# Altium schematic sheet COBConnector.SchDoc
size C; SheetNumber: 2; SheetTotal: 3
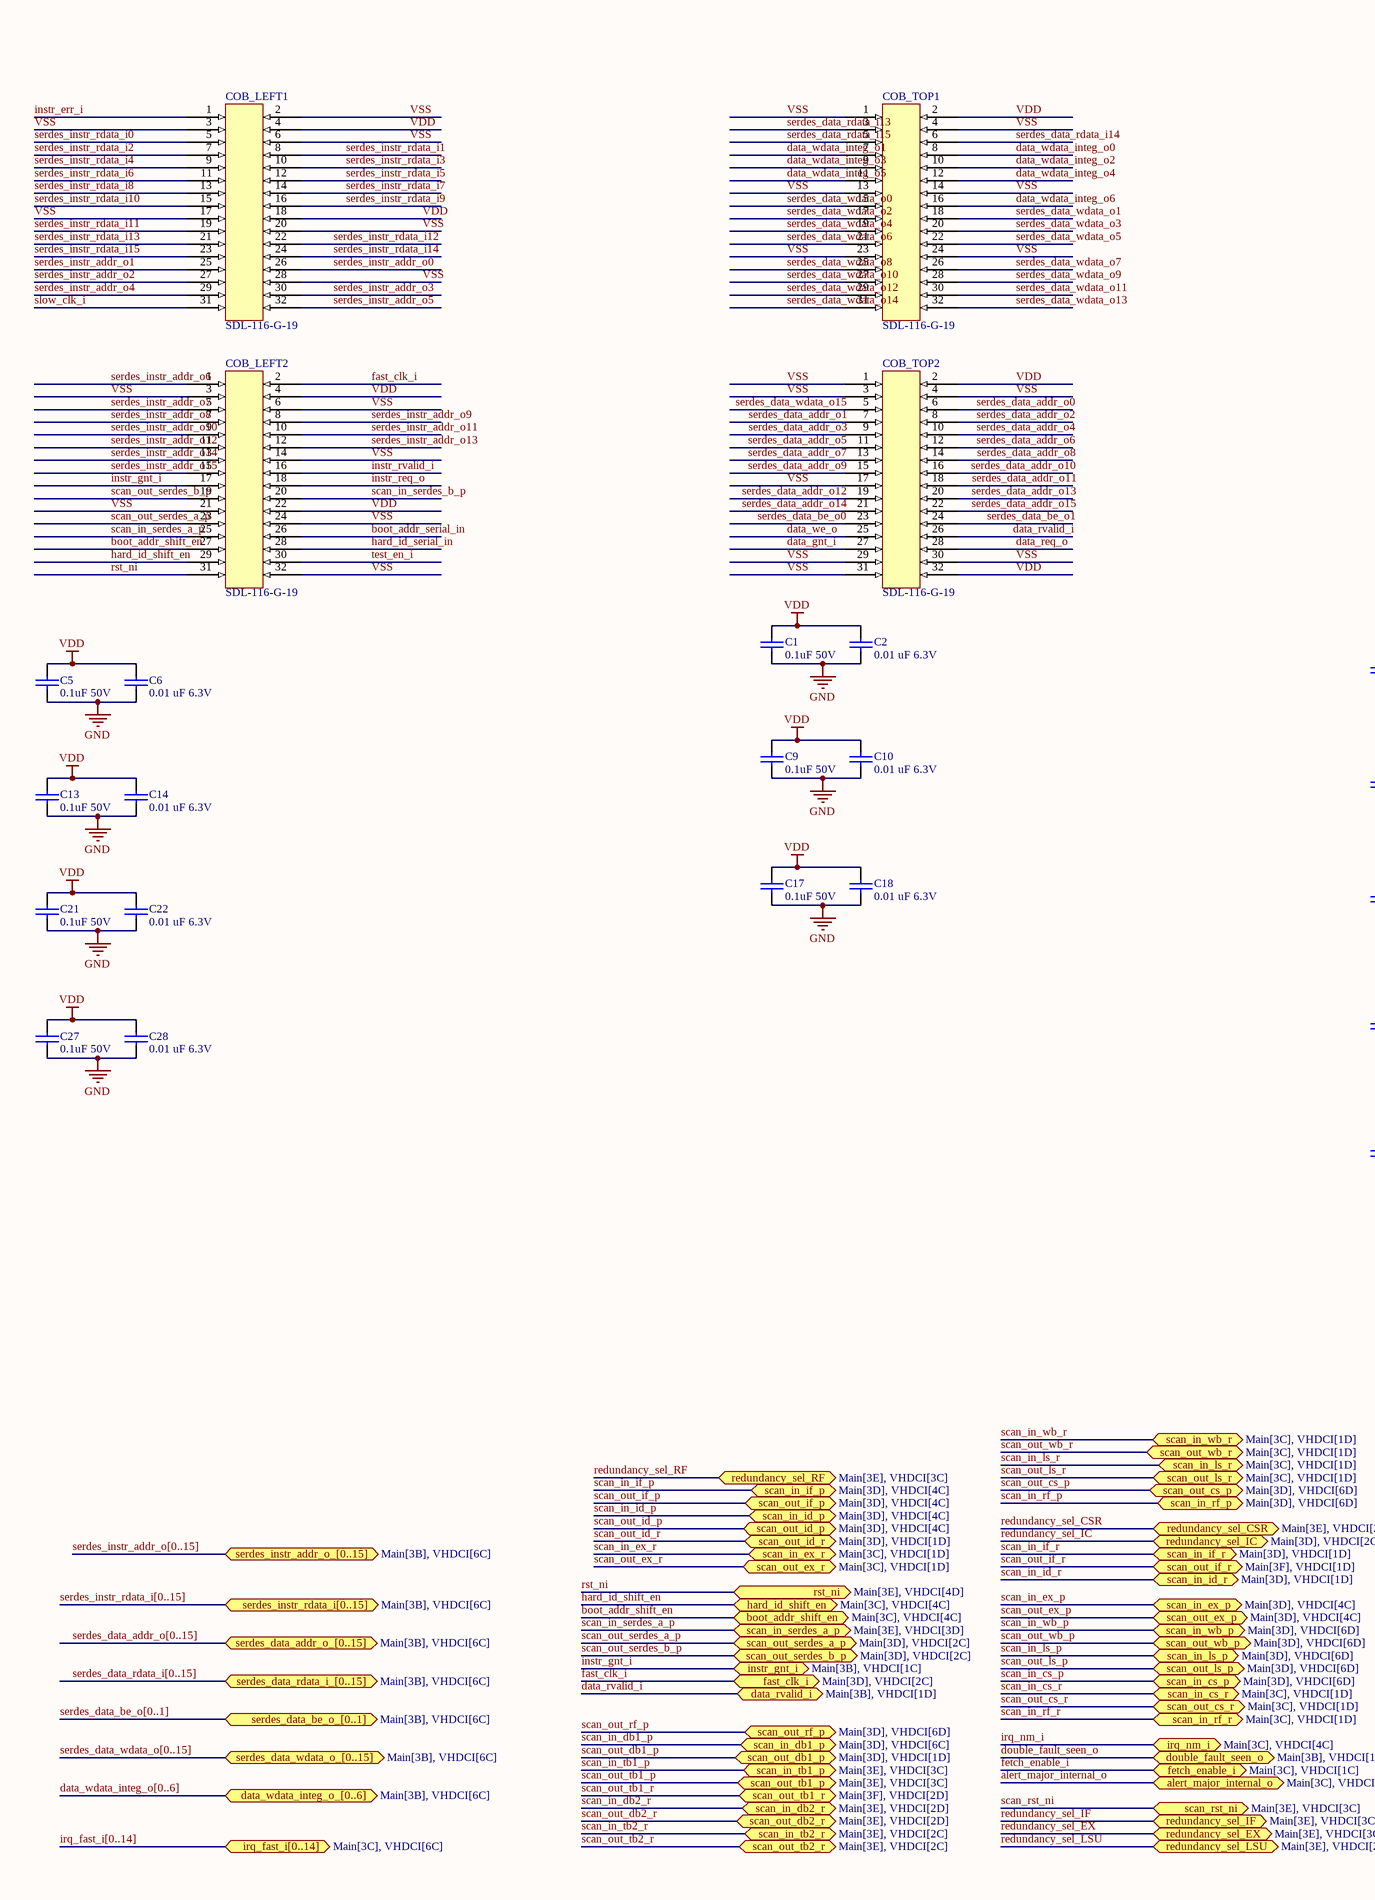
[diagram p0: COBConnector.SchDoc, left]
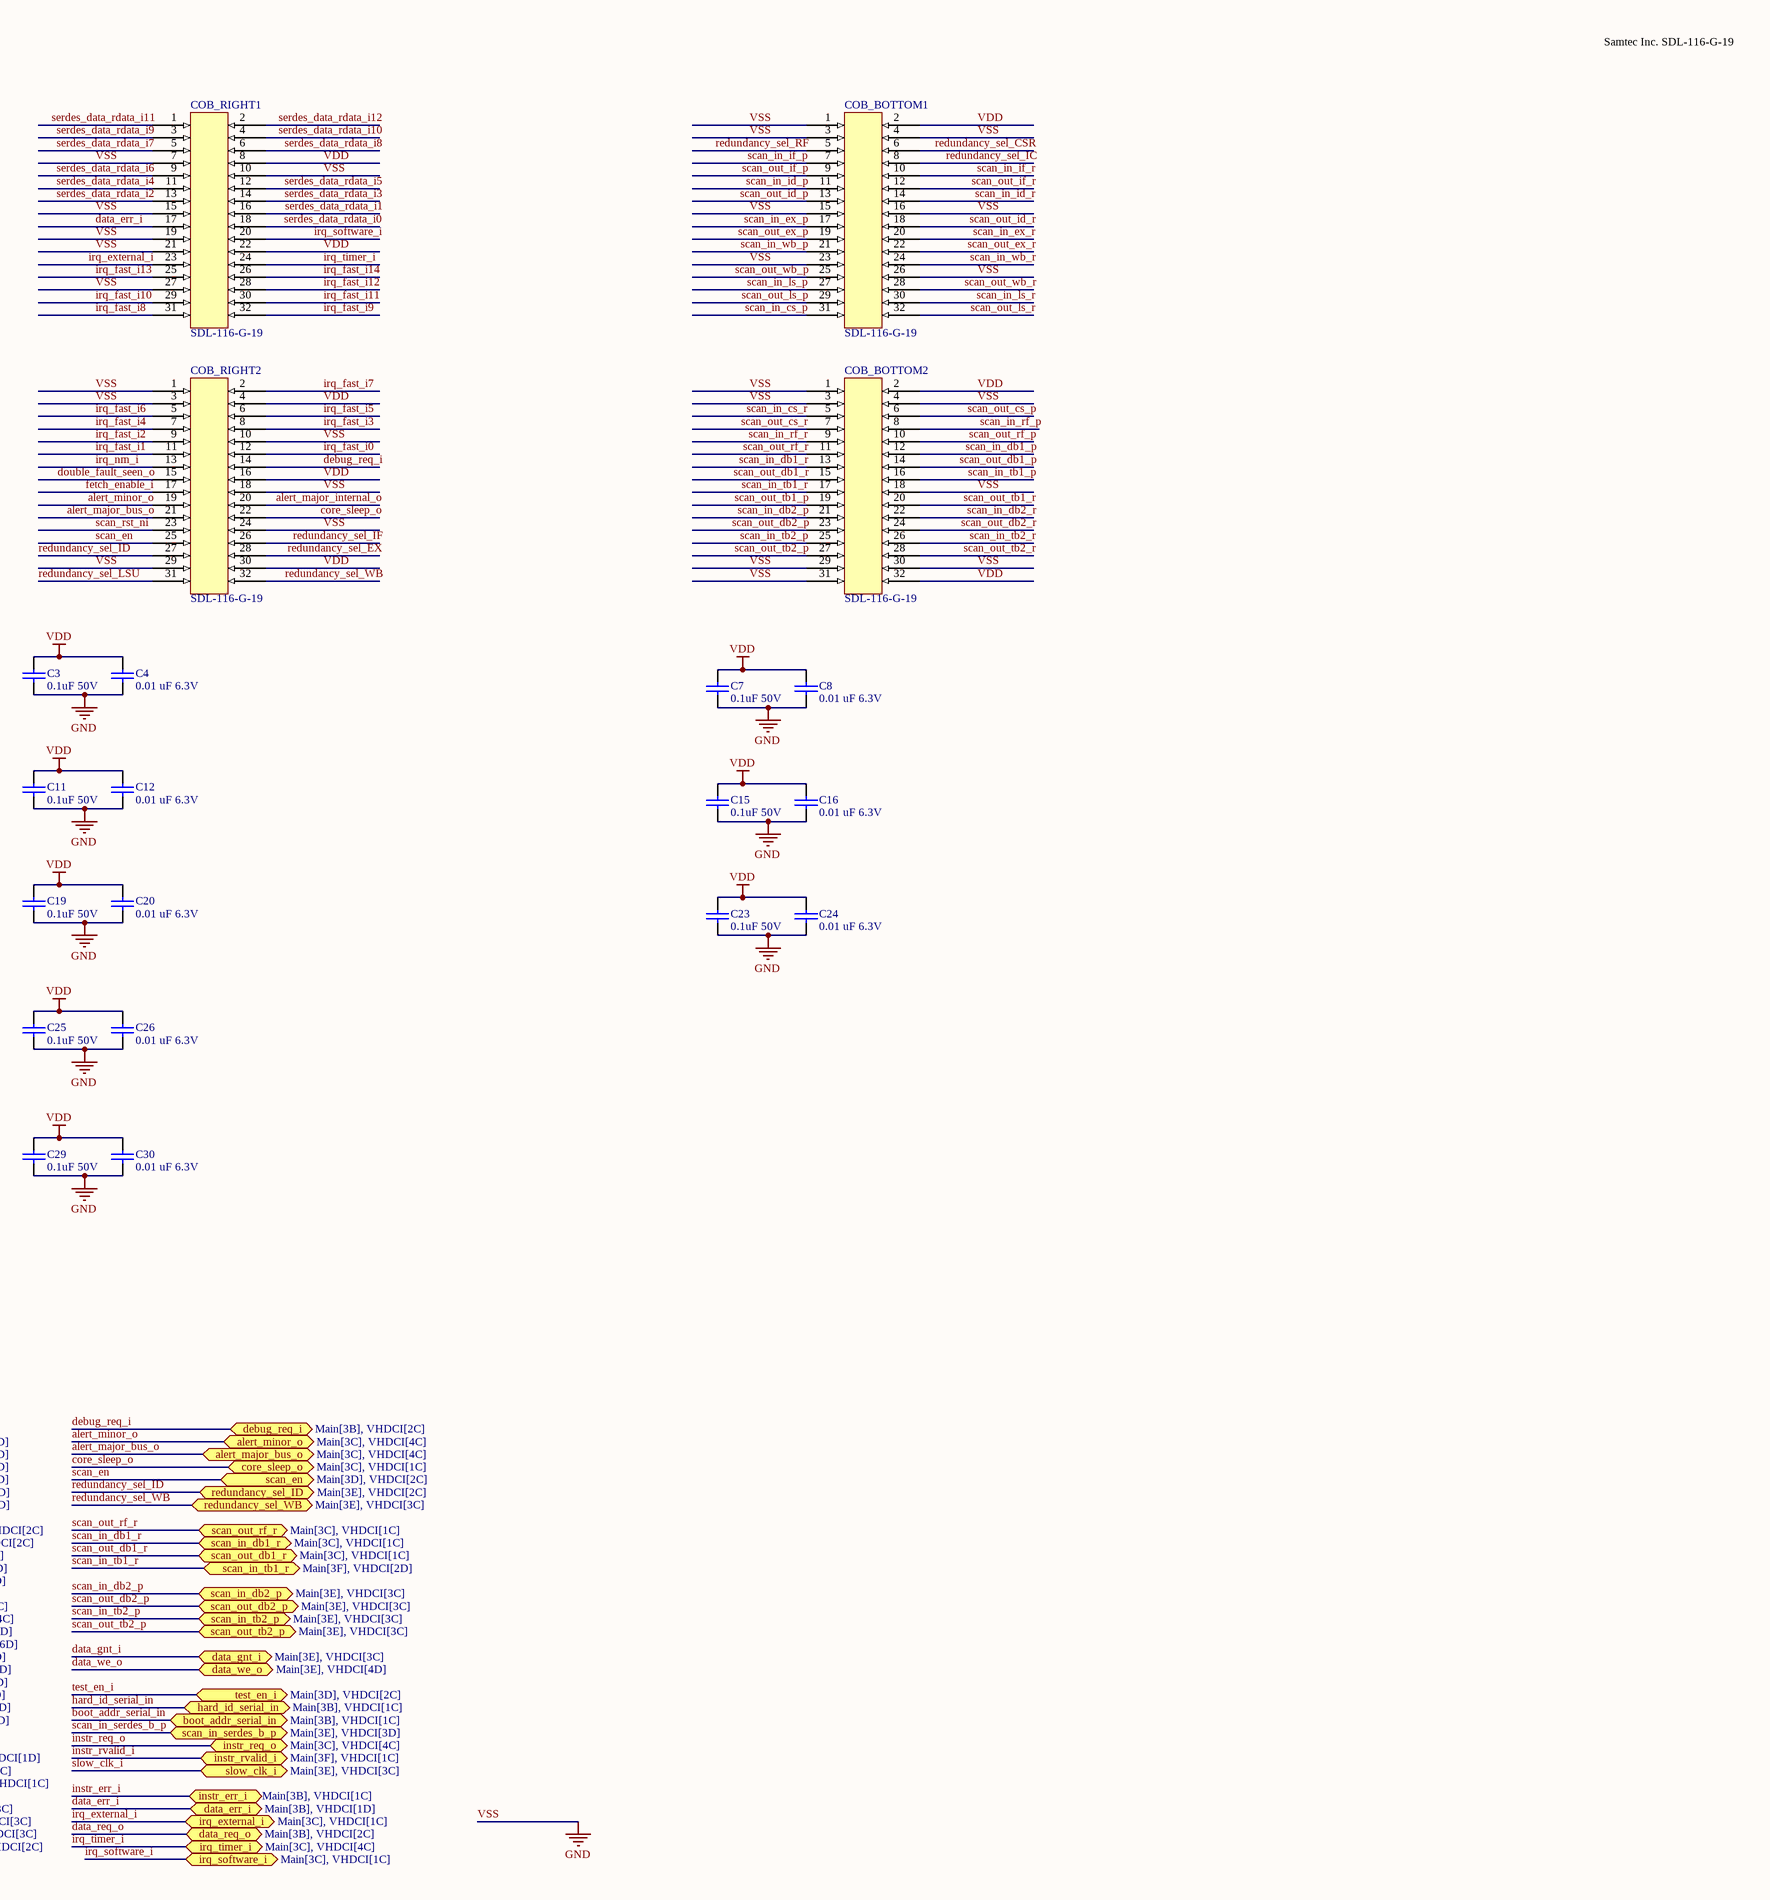
[diagram p1: COBConnector.SchDoc, right]

## Parts
C1  0.1uF 50V  [C0603-XXXXXX-XXX]
C2  0.01 uF 6.3V  [C0603-XXXXXX-XXX]
C3  0.1uF 50V  [C0603-XXXXXX-XXX]
C4  0.01 uF 6.3V  [C0603-XXXXXX-XXX]
C5  0.1uF 50V  [C0603-XXXXXX-XXX]
C6  0.01 uF 6.3V  [C0603-XXXXXX-XXX]
C7  0.1uF 50V  [C0603-XXXXXX-XXX]
C8  0.01 uF 6.3V  [C0603-XXXXXX-XXX]
C9  0.1uF 50V  [C0603-XXXXXX-XXX]
C10  0.01 uF 6.3V  [C0603-XXXXXX-XXX]
C11  0.1uF 50V  [C0603-XXXXXX-XXX]
C12  0.01 uF 6.3V  [C0603-XXXXXX-XXX]
C13  0.1uF 50V  [C0603-XXXXXX-XXX]
C14  0.01 uF 6.3V  [C0603-XXXXXX-XXX]
C15  0.1uF 50V  [C0603-XXXXXX-XXX]
C16  0.01 uF 6.3V  [C0603-XXXXXX-XXX]
C17  0.1uF 50V  [C0603-XXXXXX-XXX]
C18  0.01 uF 6.3V  [C0603-XXXXXX-XXX]
C19  0.1uF 50V  [C0603-XXXXXX-XXX]
C20  0.01 uF 6.3V  [C0603-XXXXXX-XXX]
C21  0.1uF 50V  [C0603-XXXXXX-XXX]
C22  0.01 uF 6.3V  [C0603-XXXXXX-XXX]
C23  0.1uF 50V  [C0603-XXXXXX-XXX]
C24  0.01 uF 6.3V  [C0603-XXXXXX-XXX]
C25  0.1uF 50V  [C0603-XXXXXX-XXX]
C26  0.01 uF 6.3V  [C0603-XXXXXX-XXX]
C27  0.1uF 50V  [C0603-XXXXXX-XXX]
C28  0.01 uF 6.3V  [C0603-XXXXXX-XXX]
C29  0.1uF 50V  [C0603-XXXXXX-XXX]
C30  0.01 uF 6.3V  [C0603-XXXXXX-XXX]
COB_BOTTOM1  SDL-116-G-19  [CON32_2X16_TU_DSL_SAI]
COB_BOTTOM2  SDL-116-G-19  [CON32_2X16_TU_DSL_SAI]
COB_LEFT1  SDL-116-G-19  [CON32_2X16_TU_DSL_SAI]
COB_LEFT2  SDL-116-G-19  [CON32_2X16_TU_DSL_SAI]
COB_RIGHT1  SDL-116-G-19  [CON32_2X16_TU_DSL_SAI]
COB_RIGHT2  SDL-116-G-19  [CON32_2X16_TU_DSL_SAI]
COB_TOP1  SDL-116-G-19  [CON32_2X16_TU_DSL_SAI]
COB_TOP2  SDL-116-G-19  [CON32_2X16_TU_DSL_SAI]

## Ports
alert_major_bus_o (bidir, see Main[3C], VHDCI[4C]), alert_major_internal_o (bidir, see Main[3C], VHDCI[1C]), alert_minor_o (bidir, see Main[3C], VHDCI[4C]), boot_addr_serial_in (bidir, see Main[3B], VHDCI[1C]), boot_addr_shift_en (bidir, see Main[3C], VHDCI[4C]), core_sleep_o (bidir, see Main[3C], VHDCI[1C]), data_err_i (bidir, see Main[3B], VHDCI[1D]), data_gnt_i (bidir, see Main[3E], VHDCI[3C]), data_req_o (bidir, see Main[3B], VHDCI[2C]), data_rvalid_i (bidir, see Main[3B], VHDCI[1D]), data_wdata_integ_o_[0..6] (bidir, see Main[3B], VHDCI[6C]), data_we_o (bidir, see Main[3E], VHDCI[4D]), debug_req_i (bidir, see Main[3B], VHDCI[2C]), double_fault_seen_o (bidir, see Main[3B], VHDCI[1D]), fast_clk_i (bidir, see Main[3D], VHDCI[2C]), fetch_enable_i (bidir, see Main[3C], VHDCI[1C]), hard_id_serial_in (bidir, see Main[3B], VHDCI[1C]), hard_id_shift_en (bidir, see Main[3C], VHDCI[4C]), instr_err_i (bidir, see Main[3B], VHDCI[1C]), instr_gnt_i (bidir, see Main[3B], VHDCI[1C]), instr_req_o (bidir, see Main[3C], VHDCI[4C]), instr_rvalid_i (bidir, see Main[3F], VHDCI[1C]), irq_external_i (bidir, see Main[3C], VHDCI[1C]), irq_fast_i[0..14] (bidir, see Main[3C], VHDCI[6C]), irq_nm_i (bidir, see Main[3C], VHDCI[4C]), irq_software_i (bidir, see Main[3C], VHDCI[1C]), irq_timer_i (bidir, see Main[3C], VHDCI[4C]), redundancy_sel_CSR (bidir, see Main[3E], VHDCI[2C]), redundancy_sel_EX (bidir, see Main[3E], VHDCI[3C]), redundancy_sel_IC (bidir, see Main[3D], VHDCI[2C]), redundancy_sel_ID (bidir, see Main[3E], VHDCI[2C]), redundancy_sel_IF (bidir, see Main[3E], VHDCI[3C]), redundancy_sel_LSU (bidir, see Main[3E], VHDCI[2C]), redundancy_sel_RF (bidir, see Main[3E], VHDCI[3C]), redundancy_sel_WB (bidir, see Main[3E], VHDCI[3C]), rst_ni (bidir, see Main[3E], VHDCI[4D]), scan_en (bidir, see Main[3D], VHDCI[2C]), scan_in_cs_p (bidir, see Main[3D], VHDCI[6D]), scan_in_cs_r (bidir, see Main[3C], VHDCI[1D]), scan_in_db1_p (bidir, see Main[3D], VHDCI[6C]), scan_in_db1_r (bidir, see Main[3C], VHDCI[1C]), scan_in_db2_p (bidir, see Main[3E], VHDCI[3C]), scan_in_db2_r (bidir, see Main[3E], VHDCI[2D]), scan_in_ex_p (bidir, see Main[3D], VHDCI[4C]), scan_in_ex_r (bidir, see Main[3C], VHDCI[1D]), scan_in_id_p (bidir, see Main[3D], VHDCI[4C]), scan_in_id_r (bidir, see Main[3D], VHDCI[1D]), scan_in_if_p (bidir, see Main[3D], VHDCI[4C]), scan_in_if_r (bidir, see Main[3D], VHDCI[1D]), scan_in_ls_p (bidir, see Main[3D], VHDCI[6D]), scan_in_ls_r (bidir, see Main[3C], VHDCI[1D]), scan_in_rf_p (bidir, see Main[3D], VHDCI[6D]), scan_in_rf_r (bidir, see Main[3C], VHDCI[1D]), scan_in_serdes_a_p (bidir, see Main[3E], VHDCI[3D]), scan_in_serdes_b_p (bidir, see Main[3E], VHDCI[3D]), scan_in_tb1_p (bidir, see Main[3E], VHDCI[3C]), scan_in_tb1_r (bidir, see Main[3F], VHDCI[2D]), scan_in_tb2_p (bidir, see Main[3E], VHDCI[3C]), scan_in_tb2_r (bidir, see Main[3E], VHDCI[2C]), scan_in_wb_p (bidir, see Main[3D], VHDCI[6D]), scan_in_wb_r (bidir, see Main[3C], VHDCI[1D]), scan_out_cs_p (bidir, see Main[3D], VHDCI[6D]), scan_out_cs_r (bidir, see Main[3C], VHDCI[1D]), scan_out_db1_p (bidir, see Main[3D], VHDCI[1D]), scan_out_db1_r (bidir, see Main[3C], VHDCI[1C]), scan_out_db2_p (bidir, see Main[3E], VHDCI[3C]), scan_out_db2_r (bidir, see Main[3E], VHDCI[2D]), scan_out_ex_p (bidir, see Main[3D], VHDCI[4C]), scan_out_ex_r (bidir, see Main[3C], VHDCI[1D]), scan_out_id_p (bidir, see Main[3D], VHDCI[4C]), scan_out_id_r (bidir, see Main[3D], VHDCI[1D]), scan_out_if_p (bidir, see Main[3D], VHDCI[4C]), scan_out_if_r (bidir, see Main[3F], VHDCI[1D]), scan_out_ls_p (bidir, see Main[3D], VHDCI[6D]), scan_out_ls_r (bidir, see Main[3C], VHDCI[1D]), scan_out_rf_p (bidir, see Main[3D], VHDCI[6D]), scan_out_rf_r (bidir, see Main[3C], VHDCI[1C]), scan_out_serdes_a_p (bidir, see Main[3D], VHDCI[2C]), scan_out_serdes_b_p (bidir, see Main[3D], VHDCI[2C]), scan_out_tb1_p (bidir, see Main[3E], VHDCI[3C]), scan_out_tb1_r (bidir, see Main[3F], VHDCI[2D]), scan_out_tb2_p (bidir, see Main[3E], VHDCI[3C]), scan_out_tb2_r (bidir, see Main[3E], VHDCI[2C]), scan_out_wb_p (bidir, see Main[3D], VHDCI[6D]), scan_out_wb_r (bidir, see Main[3C], VHDCI[1D]), scan_rst_ni (bidir, see Main[3E], VHDCI[3C]), serdes_data_addr_o_[0..15] (bidir, see Main[3B], VHDCI[6C]), serdes_data_be_o_[0..1] (bidir, see Main[3B], VHDCI[6C]), serdes_data_rdata_i_[0..15] (bidir, see Main[3B], VHDCI[6C]), serdes_data_wdata_o_[0..15] (bidir, see Main[3B], VHDCI[6C]), serdes_instr_addr_o_[0..15] (bidir, see Main[3B], VHDCI[6C]), serdes_instr_rdata_i[0..15] (bidir, see Main[3B], VHDCI[6C]), slow_clk_i (bidir, see Main[3E], VHDCI[3C]), test_en_i (bidir, see Main[3D], VHDCI[2C])

## Nets
VDD: C1.1 C2.1 C3.1 C4.1 C5.1 C6.1 C7.1 C8.1 C9.1 C10.1 C11.1 C12.1 C13.1 C14.1 C15.1 C16.1 C17.1 C18.1 C19.1 C20.1 C21.1 C22.1 C23.1 C24.1 C25.1 C26.1 C27.1 C28.1 C29.1 C30.1 COB_BOTTOM1.2 COB_BOTTOM2.2 COB_BOTTOM2.32 COB_LEFT1.4 COB_LEFT1.18 COB_LEFT2.4 COB_LEFT2.22 COB_RIGHT1.8 COB_RIGHT1.22 COB_RIGHT2.4 COB_RIGHT2.16 COB_RIGHT2.30 COB_TOP1.2 COB_TOP2.2 COB_TOP2.32
VSS: C1.2 C2.2 C3.2 C4.2 C5.2 C6.2 C7.2 C8.2 C9.2 C10.2 C11.2 C12.2 C13.2 C14.2 C15.2 C16.2 C17.2 C18.2 C19.2 C20.2 C21.2 C22.2 C23.2 C24.2 C25.2 C26.2 C27.2 C28.2 C29.2 C30.2 COB_BOTTOM1.1 COB_BOTTOM1.3 COB_BOTTOM1.4 COB_BOTTOM1.15 COB_BOTTOM1.16 COB_BOTTOM1.23 COB_BOTTOM1.26 COB_BOTTOM2.1 COB_BOTTOM2.3 COB_BOTTOM2.4 COB_BOTTOM2.18 COB_BOTTOM2.29 COB_BOTTOM2.30 COB_BOTTOM2.31 COB_LEFT1.2 COB_LEFT1.3 COB_LEFT1.6 COB_LEFT1.17 COB_LEFT1.20 COB_LEFT1.28 COB_LEFT2.3 COB_LEFT2.6 COB_LEFT2.14 COB_LEFT2.21 COB_LEFT2.24 COB_LEFT2.32 COB_RIGHT1.7 COB_RIGHT1.10 COB_RIGHT1.15 COB_RIGHT1.19 COB_RIGHT1.21 COB_RIGHT1.27 COB_RIGHT2.1 COB_RIGHT2.3 COB_RIGHT2.10 COB_RIGHT2.18 COB_RIGHT2.24 COB_RIGHT2.29 COB_TOP1.1 COB_TOP1.4 COB_TOP1.13 COB_TOP1.14 COB_TOP1.23 COB_TOP1.24 COB_TOP2.1 COB_TOP2.3 COB_TOP2.4 COB_TOP2.17 COB_TOP2.29 COB_TOP2.30 COB_TOP2.31  [also labelled GND]
alert_major_bus_o: COB_RIGHT2.21 ; port alert_major_bus_o
alert_major_internal_o: COB_RIGHT2.20 ; port alert_major_internal_o
alert_minor_o: COB_RIGHT2.19 ; port alert_minor_o
boot_addr_serial_in: COB_LEFT2.26 ; port boot_addr_serial_in
boot_addr_shift_en: COB_LEFT2.27 ; port boot_addr_shift_en
core_sleep_o: COB_RIGHT2.22 ; port core_sleep_o
data_err_i: COB_RIGHT1.17 ; port data_err_i
data_gnt_i: COB_TOP2.27 ; port data_gnt_i
data_req_o: COB_TOP2.28 ; port data_req_o
data_rvalid_i: COB_TOP2.26 ; port data_rvalid_i
data_wdata_integ_o0: COB_TOP1.8
data_wdata_integ_o1: COB_TOP1.7
data_wdata_integ_o2: COB_TOP1.10
data_wdata_integ_o3: COB_TOP1.9
data_wdata_integ_o4: COB_TOP1.12
data_wdata_integ_o5: COB_TOP1.11
data_wdata_integ_o6: COB_TOP1.16
data_we_o: COB_TOP2.25 ; port data_we_o
debug_req_i: COB_RIGHT2.14 ; port debug_req_i
double_fault_seen_o: COB_RIGHT2.15 ; port double_fault_seen_o
fast_clk_i: COB_LEFT2.2 ; port fast_clk_i
fetch_enable_i: COB_RIGHT2.17 ; port fetch_enable_i
hard_id_serial_in: COB_LEFT2.28 ; port hard_id_serial_in
hard_id_shift_en: COB_LEFT2.29 ; port hard_id_shift_en
instr_err_i: COB_LEFT1.1 ; port instr_err_i
instr_gnt_i: COB_LEFT2.17 ; port instr_gnt_i
instr_req_o: COB_LEFT2.18 ; port instr_req_o
instr_rvalid_i: COB_LEFT2.16 ; port instr_rvalid_i
irq_external_i: COB_RIGHT1.23 ; port irq_external_i
irq_fast_i0: COB_RIGHT2.12
irq_fast_i1: COB_RIGHT2.11
irq_fast_i2: COB_RIGHT2.9
irq_fast_i3: COB_RIGHT2.8
irq_fast_i4: COB_RIGHT2.7
irq_fast_i5: COB_RIGHT2.6
irq_fast_i6: COB_RIGHT2.5
irq_fast_i7: COB_RIGHT2.2
irq_fast_i8: COB_RIGHT1.31
irq_fast_i9: COB_RIGHT1.32
irq_fast_i10: COB_RIGHT1.29
irq_fast_i11: COB_RIGHT1.30
irq_fast_i12: COB_RIGHT1.28
irq_fast_i13: COB_RIGHT1.25
irq_fast_i14: COB_RIGHT1.26
irq_nm_i: COB_RIGHT2.13 ; port irq_nm_i
irq_software_i: COB_RIGHT1.20 ; port irq_software_i
irq_timer_i: COB_RIGHT1.24 ; port irq_timer_i
redundancy_sel_CSR: COB_BOTTOM1.6 ; port redundancy_sel_CSR
redundancy_sel_EX: COB_RIGHT2.28 ; port redundancy_sel_EX
redundancy_sel_IC: COB_BOTTOM1.8 ; port redundancy_sel_IC
redundancy_sel_ID: COB_RIGHT2.27 ; port redundancy_sel_ID
redundancy_sel_IF: COB_RIGHT2.26 ; port redundancy_sel_IF
redundancy_sel_LSU: COB_RIGHT2.31 ; port redundancy_sel_LSU
redundancy_sel_RF: COB_BOTTOM1.5 ; port redundancy_sel_RF
redundancy_sel_WB: COB_RIGHT2.32 ; port redundancy_sel_WB
rst_ni: COB_LEFT2.31 ; port rst_ni
scan_en: COB_RIGHT2.25 ; port scan_en
scan_in_cs_p: COB_BOTTOM1.31 ; port scan_in_cs_p
scan_in_cs_r: COB_BOTTOM2.5 ; port scan_in_cs_r
scan_in_db1_p: COB_BOTTOM2.12 ; port scan_in_db1_p
scan_in_db1_r: COB_BOTTOM2.13 ; port scan_in_db1_r
scan_in_db2_p: COB_BOTTOM2.21 ; port scan_in_db2_p
scan_in_db2_r: COB_BOTTOM2.22 ; port scan_in_db2_r
scan_in_ex_p: COB_BOTTOM1.17 ; port scan_in_ex_p
scan_in_ex_r: COB_BOTTOM1.20 ; port scan_in_ex_r
scan_in_id_p: COB_BOTTOM1.11 ; port scan_in_id_p
scan_in_id_r: COB_BOTTOM1.14 ; port scan_in_id_r
scan_in_if_p: COB_BOTTOM1.7 ; port scan_in_if_p
scan_in_if_r: COB_BOTTOM1.10 ; port scan_in_if_r
scan_in_ls_p: COB_BOTTOM1.27 ; port scan_in_ls_p
scan_in_ls_r: COB_BOTTOM1.30 ; port scan_in_ls_r
scan_in_rf_p: COB_BOTTOM2.8 ; port scan_in_rf_p
scan_in_rf_r: COB_BOTTOM2.9 ; port scan_in_rf_r
scan_in_serdes_a_p: COB_LEFT2.25 ; port scan_in_serdes_a_p
scan_in_serdes_b_p: COB_LEFT2.20 ; port scan_in_serdes_b_p
scan_in_tb1_p: COB_BOTTOM2.16 ; port scan_in_tb1_p
scan_in_tb1_r: COB_BOTTOM2.17 ; port scan_in_tb1_r
scan_in_tb2_p: COB_BOTTOM2.25 ; port scan_in_tb2_p
scan_in_tb2_r: COB_BOTTOM2.26 ; port scan_in_tb2_r
scan_in_wb_p: COB_BOTTOM1.21 ; port scan_in_wb_p
scan_in_wb_r: COB_BOTTOM1.24 ; port scan_in_wb_r
scan_out_cs_p: COB_BOTTOM2.6 ; port scan_out_cs_p
scan_out_cs_r: COB_BOTTOM2.7 ; port scan_out_cs_r
scan_out_db1_p: COB_BOTTOM2.14 ; port scan_out_db1_p
scan_out_db1_r: COB_BOTTOM2.15 ; port scan_out_db1_r
scan_out_db2_p: COB_BOTTOM2.23 ; port scan_out_db2_p
scan_out_db2_r: COB_BOTTOM2.24 ; port scan_out_db2_r
scan_out_ex_p: COB_BOTTOM1.19 ; port scan_out_ex_p
scan_out_ex_r: COB_BOTTOM1.22 ; port scan_out_ex_r
scan_out_id_p: COB_BOTTOM1.13 ; port scan_out_id_p
scan_out_id_r: COB_BOTTOM1.18 ; port scan_out_id_r
scan_out_if_p: COB_BOTTOM1.9 ; port scan_out_if_p
scan_out_if_r: COB_BOTTOM1.12 ; port scan_out_if_r
scan_out_ls_p: COB_BOTTOM1.29 ; port scan_out_ls_p
scan_out_ls_r: COB_BOTTOM1.32 ; port scan_out_ls_r
scan_out_rf_p: COB_BOTTOM2.10 ; port scan_out_rf_p
scan_out_rf_r: COB_BOTTOM2.11 ; port scan_out_rf_r
scan_out_serdes_a_p: COB_LEFT2.23 ; port scan_out_serdes_a_p
scan_out_serdes_b_p: COB_LEFT2.19 ; port scan_out_serdes_b_p
scan_out_tb1_p: COB_BOTTOM2.19 ; port scan_out_tb1_p
scan_out_tb1_r: COB_BOTTOM2.20 ; port scan_out_tb1_r
scan_out_tb2_p: COB_BOTTOM2.27 ; port scan_out_tb2_p
scan_out_tb2_r: COB_BOTTOM2.28 ; port scan_out_tb2_r
scan_out_wb_p: COB_BOTTOM1.25 ; port scan_out_wb_p
scan_out_wb_r: COB_BOTTOM1.28 ; port scan_out_wb_r
scan_rst_ni: COB_RIGHT2.23 ; port scan_rst_ni
serdes_data_addr_o0: COB_TOP2.6
serdes_data_addr_o1: COB_TOP2.7
serdes_data_addr_o2: COB_TOP2.8
serdes_data_addr_o3: COB_TOP2.9
serdes_data_addr_o4: COB_TOP2.10
serdes_data_addr_o5: COB_TOP2.11
serdes_data_addr_o6: COB_TOP2.12
serdes_data_addr_o7: COB_TOP2.13
serdes_data_addr_o8: COB_TOP2.14
serdes_data_addr_o9: COB_TOP2.15
serdes_data_addr_o10: COB_TOP2.16
serdes_data_addr_o11: COB_TOP2.18
serdes_data_addr_o12: COB_TOP2.19
serdes_data_addr_o13: COB_TOP2.20
serdes_data_addr_o14: COB_TOP2.21
serdes_data_addr_o15: COB_TOP2.22
serdes_data_be_o0: COB_TOP2.23
serdes_data_be_o1: COB_TOP2.24
serdes_data_rdata_i0: COB_RIGHT1.18
serdes_data_rdata_i1: COB_RIGHT1.16
serdes_data_rdata_i2: COB_RIGHT1.13
serdes_data_rdata_i3: COB_RIGHT1.14
serdes_data_rdata_i4: COB_RIGHT1.11
serdes_data_rdata_i5: COB_RIGHT1.12
serdes_data_rdata_i6: COB_RIGHT1.9
serdes_data_rdata_i7: COB_RIGHT1.5
serdes_data_rdata_i8: COB_RIGHT1.6
serdes_data_rdata_i9: COB_RIGHT1.3
serdes_data_rdata_i10: COB_RIGHT1.4
serdes_data_rdata_i11: COB_RIGHT1.1
serdes_data_rdata_i12: COB_RIGHT1.2
serdes_data_rdata_i13: COB_TOP1.3
serdes_data_rdata_i14: COB_TOP1.6
serdes_data_rdata_i15: COB_TOP1.5
serdes_data_wdata_o0: COB_TOP1.15
serdes_data_wdata_o1: COB_TOP1.18
serdes_data_wdata_o2: COB_TOP1.17
serdes_data_wdata_o3: COB_TOP1.20
serdes_data_wdata_o4: COB_TOP1.19
serdes_data_wdata_o5: COB_TOP1.22
serdes_data_wdata_o6: COB_TOP1.21
serdes_data_wdata_o7: COB_TOP1.26
serdes_data_wdata_o8: COB_TOP1.25
serdes_data_wdata_o9: COB_TOP1.28
serdes_data_wdata_o10: COB_TOP1.27
serdes_data_wdata_o11: COB_TOP1.30
serdes_data_wdata_o12: COB_TOP1.29
serdes_data_wdata_o13: COB_TOP1.32
serdes_data_wdata_o14: COB_TOP1.31
serdes_data_wdata_o15: COB_TOP2.5
serdes_instr_addr_o0: COB_LEFT1.26
serdes_instr_addr_o1: COB_LEFT1.25
serdes_instr_addr_o2: COB_LEFT1.27
serdes_instr_addr_o3: COB_LEFT1.30
serdes_instr_addr_o4: COB_LEFT1.29
serdes_instr_addr_o5: COB_LEFT1.32
serdes_instr_addr_o6: COB_LEFT2.1
serdes_instr_addr_o7: COB_LEFT2.5
serdes_instr_addr_o8: COB_LEFT2.7
serdes_instr_addr_o9: COB_LEFT2.8
serdes_instr_addr_o10: COB_LEFT2.9
serdes_instr_addr_o11: COB_LEFT2.10
serdes_instr_addr_o12: COB_LEFT2.11
serdes_instr_addr_o13: COB_LEFT2.12
serdes_instr_addr_o14: COB_LEFT2.13
serdes_instr_addr_o15: COB_LEFT2.15
serdes_instr_rdata_i0: COB_LEFT1.5
serdes_instr_rdata_i1: COB_LEFT1.8
serdes_instr_rdata_i2: COB_LEFT1.7
serdes_instr_rdata_i3: COB_LEFT1.10
serdes_instr_rdata_i4: COB_LEFT1.9
serdes_instr_rdata_i5: COB_LEFT1.12
serdes_instr_rdata_i6: COB_LEFT1.11
serdes_instr_rdata_i7: COB_LEFT1.14
serdes_instr_rdata_i8: COB_LEFT1.13
serdes_instr_rdata_i9: COB_LEFT1.16
serdes_instr_rdata_i10: COB_LEFT1.15
serdes_instr_rdata_i11: COB_LEFT1.19
serdes_instr_rdata_i12: COB_LEFT1.22
serdes_instr_rdata_i13: COB_LEFT1.21
serdes_instr_rdata_i14: COB_LEFT1.24
serdes_instr_rdata_i15: COB_LEFT1.23
slow_clk_i: COB_LEFT1.31 ; port slow_clk_i
test_en_i: COB_LEFT2.30 ; port test_en_i

## Buses and harness runs
bus data_wdata_integ_o[0..6] = port data_wdata_integ_o_[0..6]
bus irq_fast_i[0..14] = port irq_fast_i[0..14]
bus serdes_data_addr_o[0..15] = port serdes_data_addr_o_[0..15]
bus serdes_data_be_o[0..1] = port serdes_data_be_o_[0..1]
bus serdes_data_rdata_i[0..15] = port serdes_data_rdata_i_[0..15]
bus serdes_data_wdata_o[0..15] = port serdes_data_wdata_o_[0..15]
bus serdes_instr_addr_o[0..15] = port serdes_instr_addr_o_[0..15]
bus serdes_instr_rdata_i[0..15] = port serdes_instr_rdata_i[0..15]

## Notes on the sheet
- Samtec Inc. SDL-116-G-19

## Library data of the parts
C1 C3 C5 C7 C9 C11 C13 C15 C17 C19 C21 C23 C25 C27 C29 = C0603C104M5RAC7867: 0.1 µF ±20% 50V Ceramic Capacitor X7R 0603; KMI: 821327; Value: 0.1uF 50V
C2 C4 C6 C8 C10 C12 C14 C16 C18 C20 C22 C24 C26 C28 C30 = C0603F103M9RACTU: Multilayer Ceramic Capacitors MLCC - SMD/SMT 6.3V 0.01uF X7R 0603 20%; Value: 0.01 uF 6.3V